# Altium schematic sheet IO.SchDoc
size A3
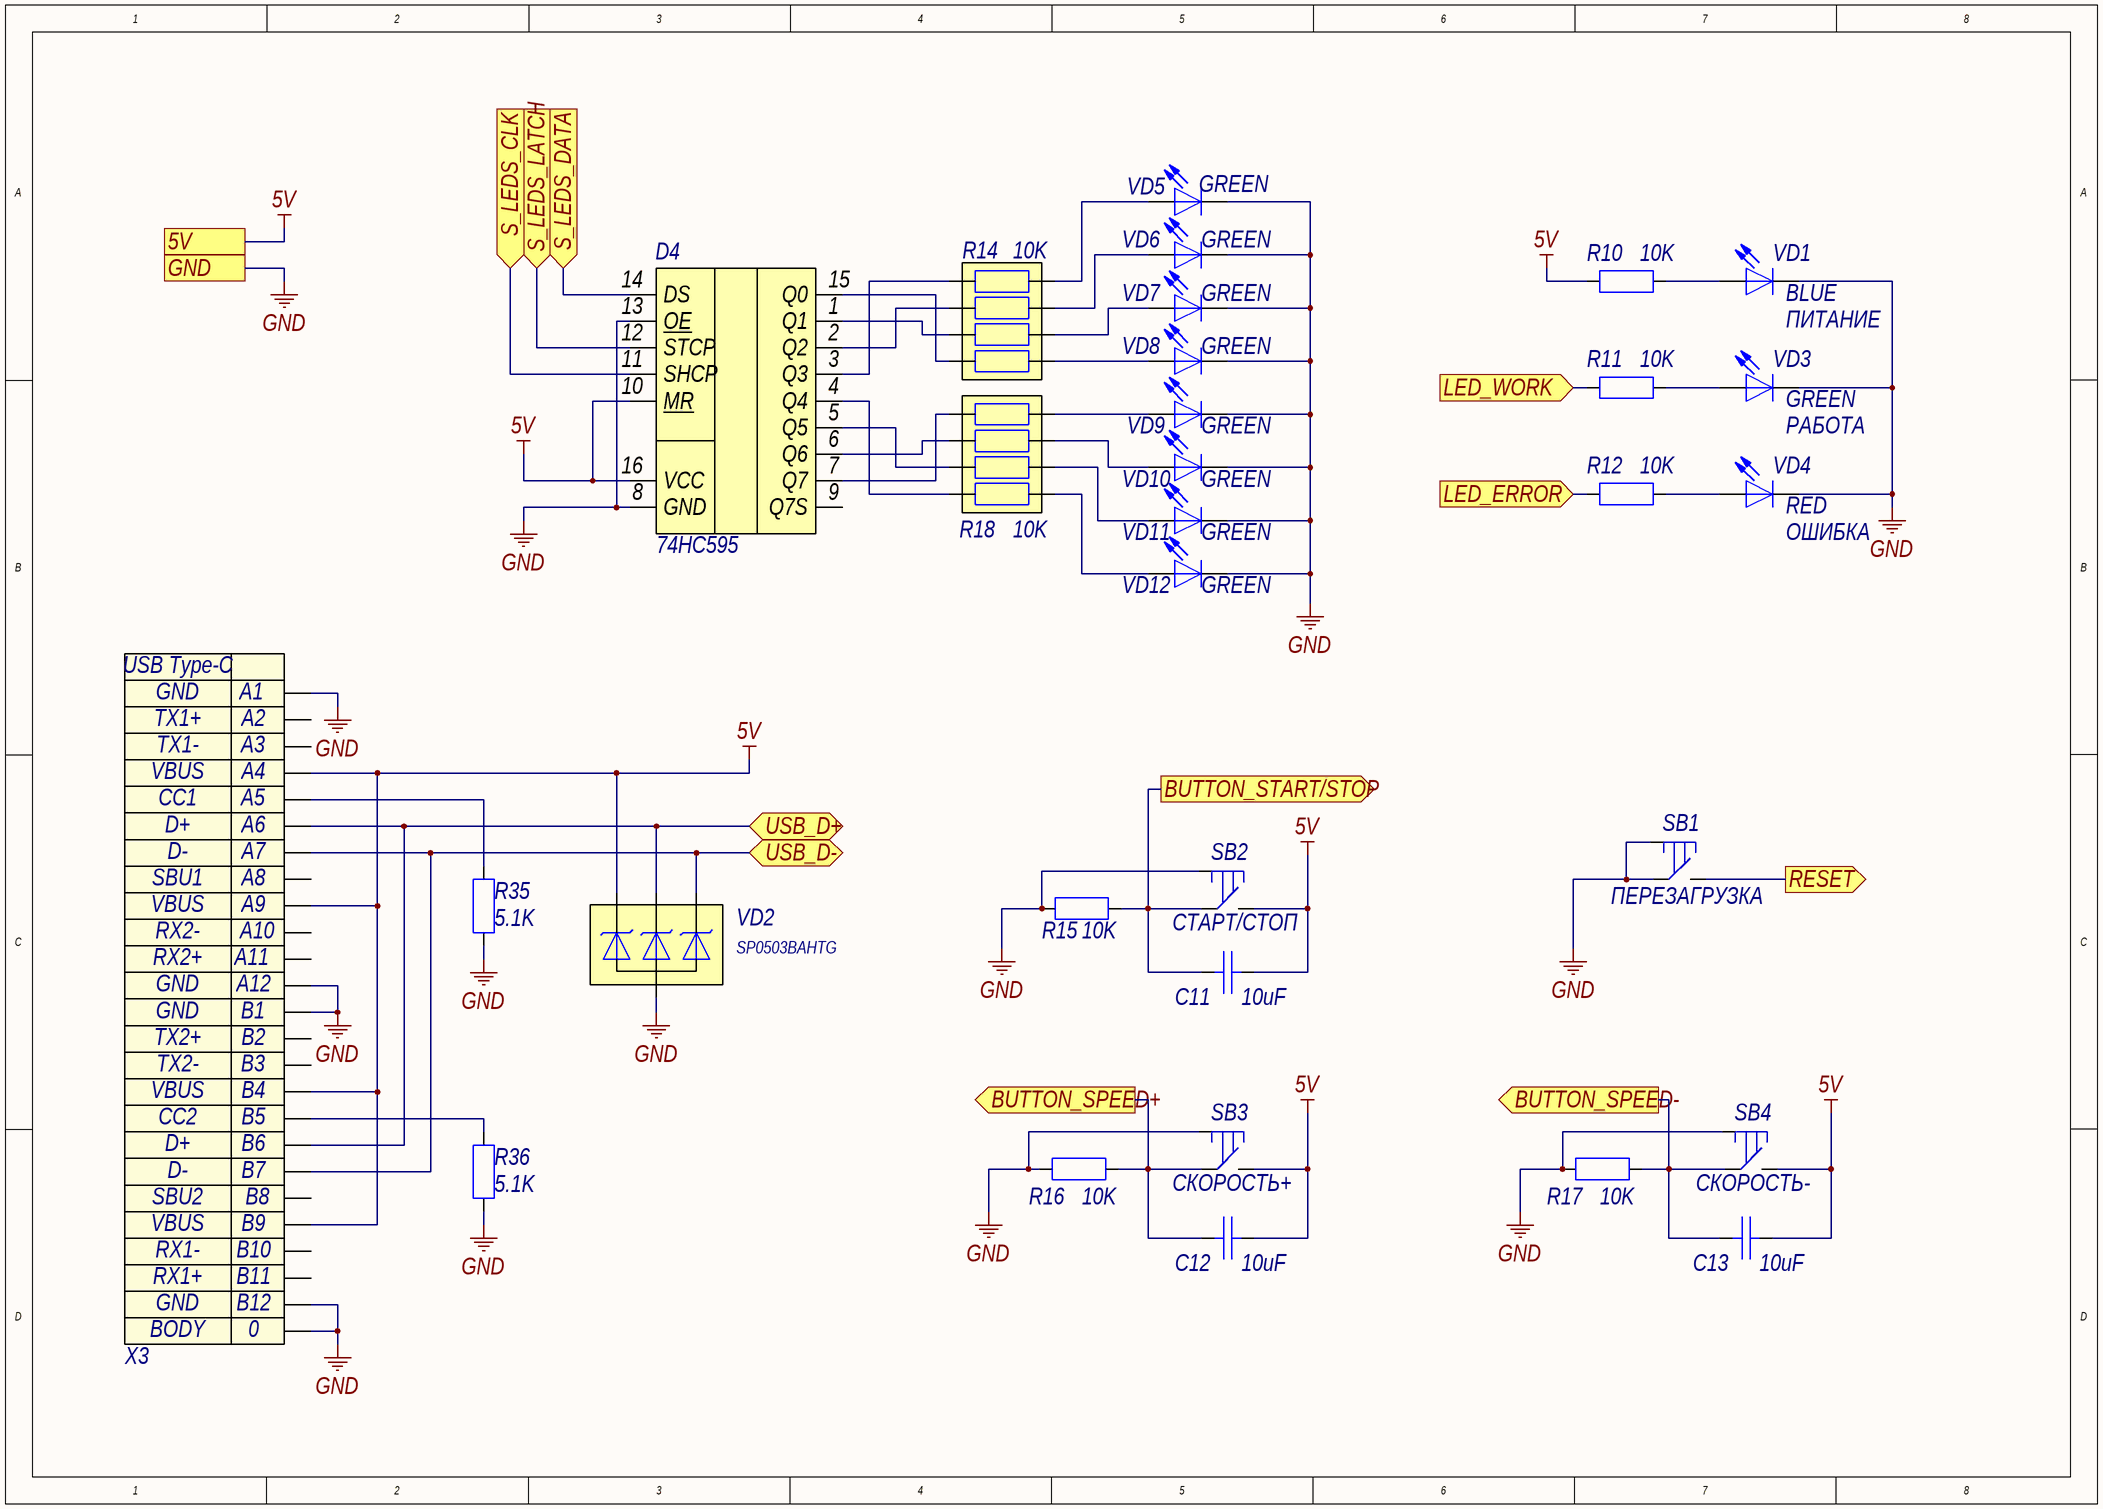
[diagram p0: IO.SchDoc]

## Parts
C11  10uF  [NPC0805]
C12  10uF  [NPC0805]
C13  10uF  [NPC0805]
D4  74HC595  [SOIC16]
R10  10K  [R0805]
R11  10K  [R0805]
R12  10K  [R0805]
R14  10K  [CAT16]
R15  10K  [R0805]
R16  10K  [R0805]
R17  10K  [R0805]
R18  10K  [CAT16]
R35  5.1K  [R0805]
R36  5.1K  [R0805]
SB1  Function: ПЕРЕЗАГРУЗКА  [1-1437565-6 WITH LABEL]
SB2  Function: СТАРТ/СТОП  [1-1437565-6 WITH LABEL]
SB3  Function: СКОРОСТЬ+  [1-1437565-6 WITH LABEL]
SB4  Function: СКОРОСТЬ-  [1-1437565-6 WITH LABEL]
VD1  Name: ПИТАНИЕ  Color: BLUE  [0805_LED _BLUE]
VD2  SP0503BAHTG  [SOT143]
VD3  Name: РАБОТА  Color: GREEN  [0805_LED _GREEN]
VD4  Name: ОШИБКА  Color: RED  [0805_LED _RED]
VD5  GREEN  [0805_LED _GREEN]
VD6  Color: GREEN  [0805_LED _GREEN]
VD7  Color: GREEN  [0805_LED _GREEN]
VD8  Color: GREEN  [0805_LED _GREEN]
VD9  Color: GREEN  [0805_LED _GREEN]
VD10  Color: GREEN  [0805_LED _GREEN]
VD11  Color: GREEN  [0805_LED _GREEN]
VD12  Color: GREEN  [0805_LED _GREEN]
X3  USB Type-C  [USB Type-C Vertical]  (value not drawn)

## Ports
5V, BUTTON_SPEED+ (out), BUTTON_SPEED- (out), BUTTON_START/STOP (out), GND, LED_ERROR (in), LED_WORK (in), RESET (out), S_LEDS_CLK (in), S_LEDS_DATA (in), S_LEDS_LATCH (in), USB_D+ (bidir), USB_D- (bidir)

## Nets
5V: C11.2 C12.2 C13.2 D4.10(MR) D4.16(VCC) R10.1 SB2.2 SB3.2 SB4.2 VD2.2(C) X3.A4 X3.A9 X3.B4 X3.B9 ; port 5V
GND: D4.8(GND) D4.13(OE) R15.1 R16.1 R17.1 R35.1 R36.1 SB1.1 SB1.3(GND) SB2.3(GND) SB3.3(GND) SB4.3(GND) VD1.1(K) VD2.1(A) VD3.1(K) VD4.1(K) VD5.1(K) VD6.1(K) VD7.1(K) VD8.1(K) VD9.1(K) VD10.1(K) VD11.1(K) VD12.1(K) X3.0 X3.A1 X3.A12 X3.B1 X3.B12 ; port GND
BUTTON_SPEED+: C12.1 R16.2 SB3.1 ; port BUTTON_SPEED+
BUTTON_SPEED-: C13.1 R17.2 SB4.1 ; port BUTTON_SPEED-
BUTTON_START/STOP: C11.1 R15.2 SB2.1 ; port BUTTON_START/STOP
LED_ERROR: R12.1 ; port LED_ERROR
LED_WORK: R11.1 ; port LED_WORK
RESET: SB1.2 ; port RESET
S_LEDS_CLK: D4.11(SHCP) ; port S_LEDS_CLK
S_LEDS_DATA: D4.14(DS) ; port S_LEDS_DATA
S_LEDS_LATCH: D4.12(STCP) ; port S_LEDS_LATCH
USB_D+: VD2.3(C) X3.A6 X3.B6 ; port USB_D+
USB_D-: VD2.4(C) X3.A7 X3.B7 ; port USB_D-
NetD4_1: D4.1(Q1) R14.3
NetD4_2: D4.2(Q2) R14.2
NetD4_3: D4.3(Q3) R14.1
NetD4_4: D4.4(Q4) R18.4
NetD4_5: D4.5(Q5) R18.3
NetD4_6: D4.6(Q6) R18.2
NetD4_7: D4.7(Q7) R18.1
NetD4_15: D4.15(Q0) R14.4
NetR10_2: R10.2 VD1.2(A)
NetR11_2: R11.2 VD3.2(A)
NetR12_2: R12.2 VD4.2(A)
NetR14_5: R14.5 VD8.2(A)
NetR14_6: R14.6 VD7.2(A)
NetR14_7: R14.7 VD6.2(A)
NetR14_8: R14.8 VD5.2(A)
NetR18_5: R18.5 VD12.2(A)
NetR18_6: R18.6 VD11.2(A)
NetR18_7: R18.7 VD10.2(A)
NetR18_8: R18.8 VD9.2(A)
NetR35_2: R35.2 X3.A5
NetR36_2: R36.2 X3.B5

Not connected (* = marked no-connect by the designer): D4 9(Q7S); X3 A2 A3 A8 A10 A11 B2 B3 B8 B10 B11

## Notes on the sheet
- (in symbol USB Type-C) GND; TX1+; TX1-; VBUS; CC1; D+; D-; SBU1; RX2-; RX2+; TX2+; TX2-; CC2; SBU2; RX1-; RX1+; BODY

## Library data of the parts
C11-C13 = Nonpolarized Capacitor: Nonpolarized Capacitor (Ceramic); Value: 10uF
D4 = 74HC595: Сдвиговый регистр, 8 каналов
R10-R12 R15-R17 R35 R36 = Resistor: Power rating: 2Вт
  R10-R12 R15-R17: Value: 10K
  R35 R36: Value: 5.1K
R14 R18 = Resistor Array: Power rating: 0,05Вт; Value: 10K
SB1-SB4 = Button_SMD: Кнопка без фиксации
VD1 VD3-VD12 = LED: Светодиод SMD; Manufacturer: KGB; Forward voltage; 25мА: 2,15В; Max. forward current (continuous): 25мА; Package: 0603
  VD5: Color: GREEN
VD2 = SP0503BAHTG: 3 TVS Diodes assembly, 5V
X3 = USB Type-C: USB Type-C connector